# Altium schematic sheet LEDControl1.SchDoc
size A3; SheetNumber: 1; SheetTotal: 3
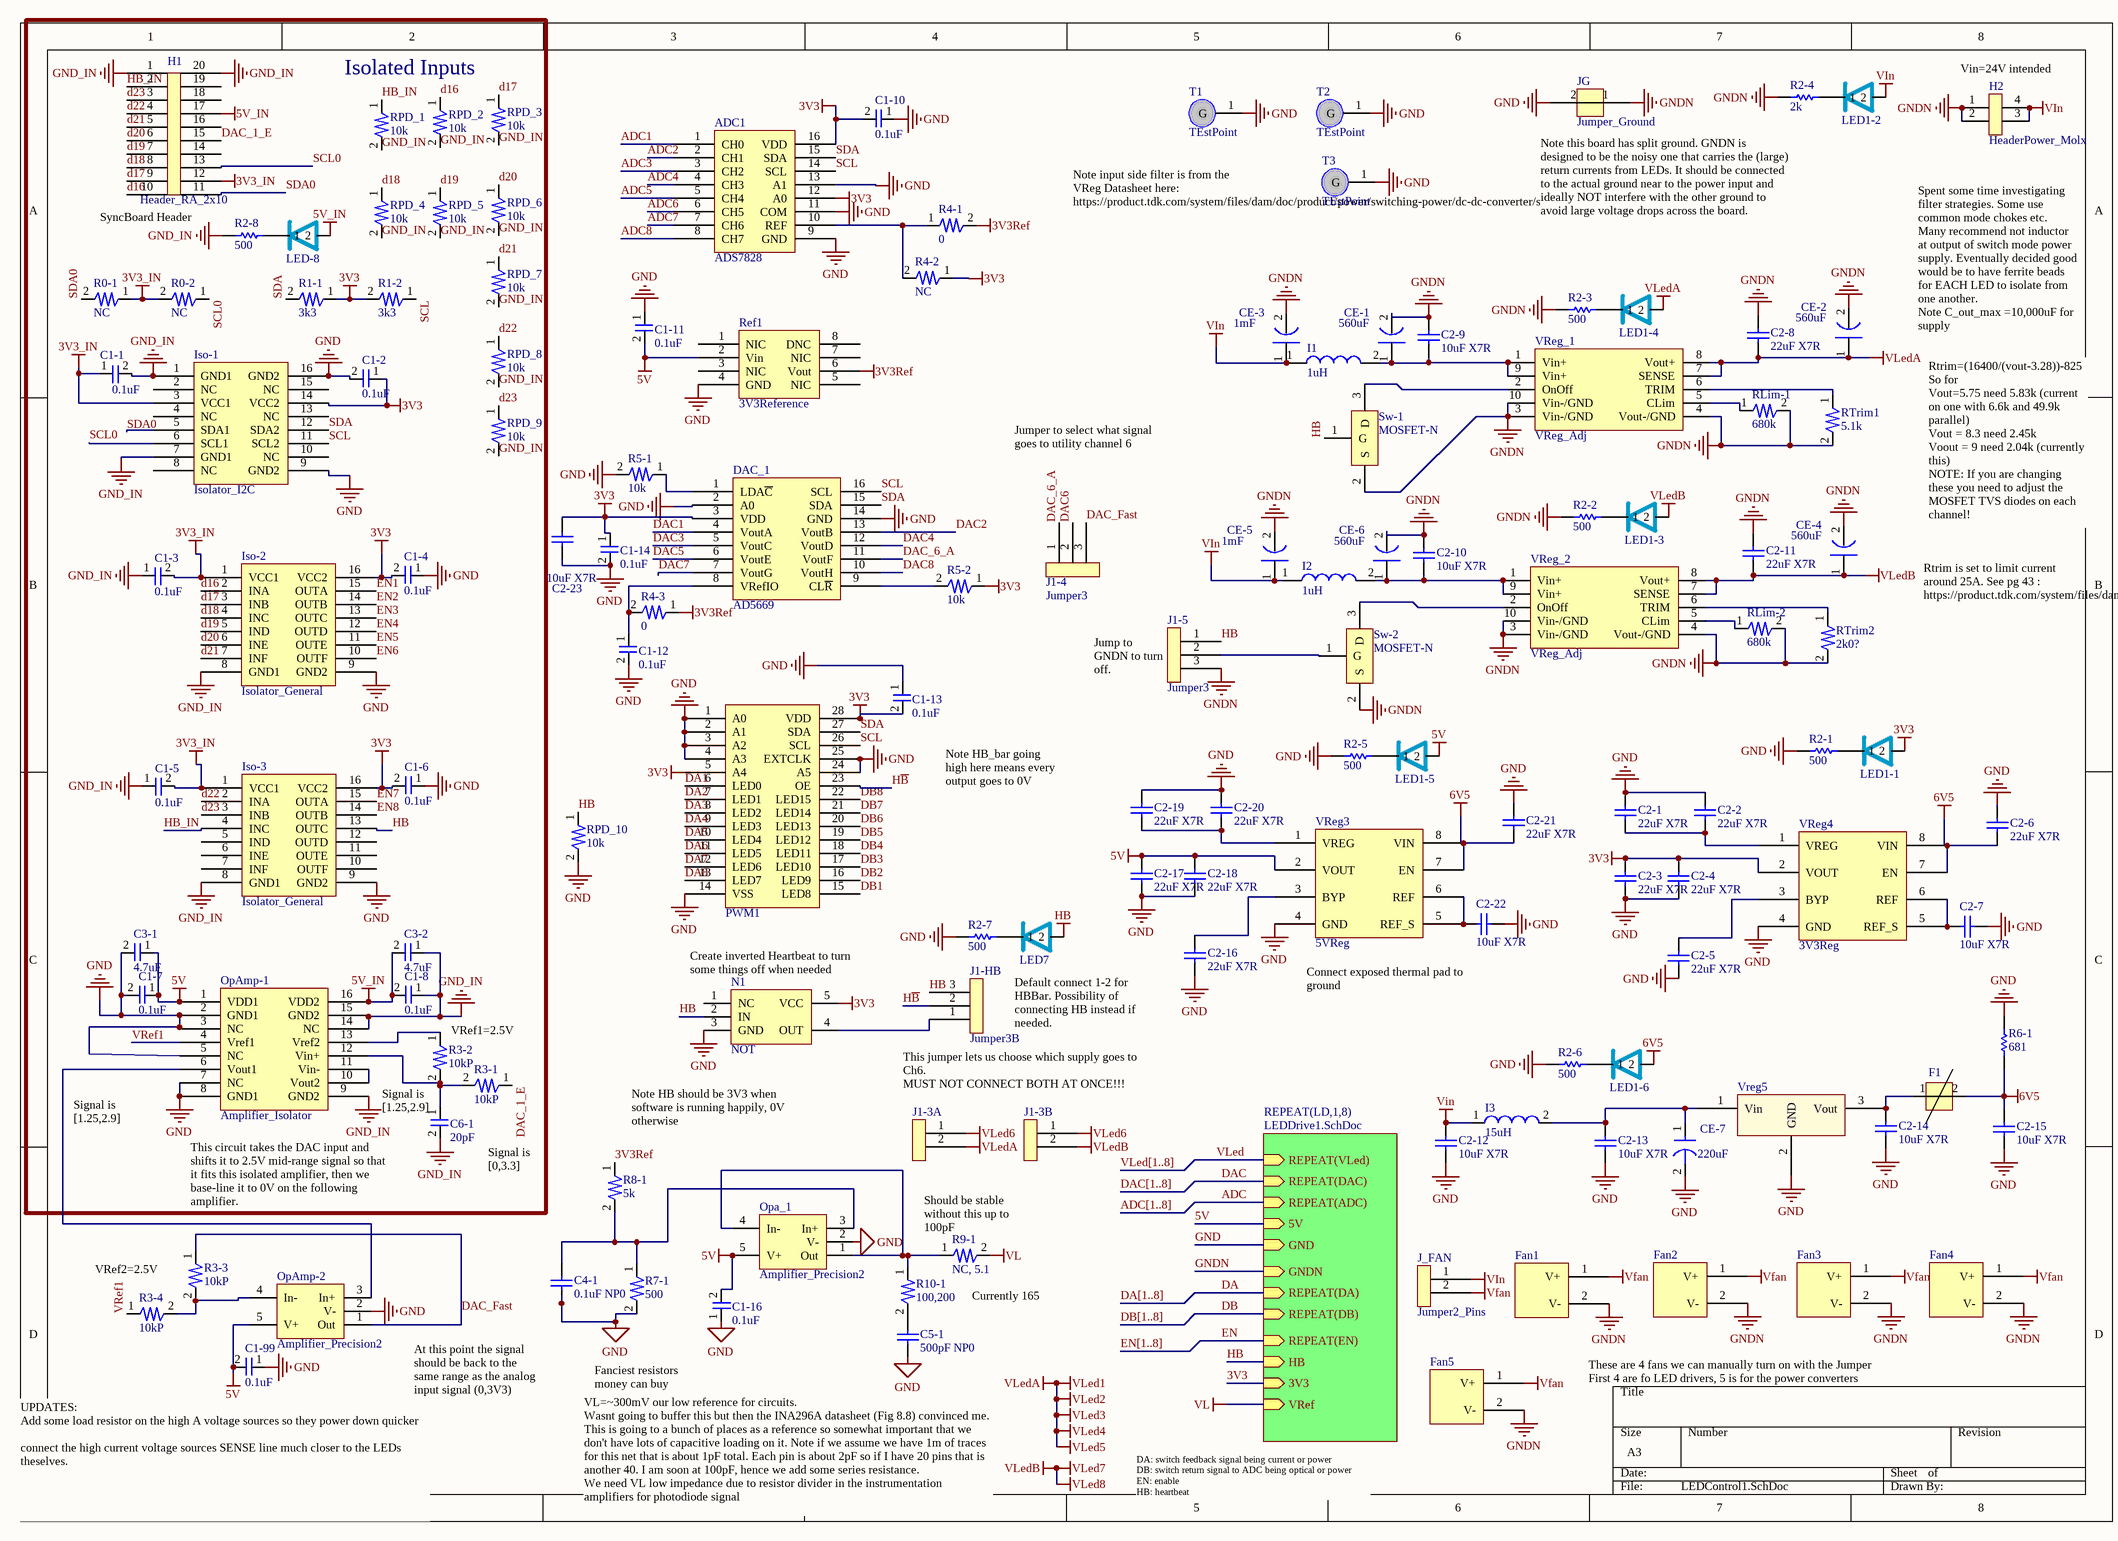
[diagram p0: LEDControl1.SchDoc]

## Parts
ADC1  ADS7828  [16-TSSOP]
C1-1  0.1uF  [0805]
C1-2  0.1uF  [0805]
C1-3  0.1uF  [0805]
C1-4  0.1uF  [0805]
C1-5  0.1uF  [0805]
C1-6  0.1uF  [0805]
C1-7  0.1uF  [0805]
C1-8  0.1uF  [0805]
C1-10  0.1uF  [0805]
C1-11  0.1uF  [0805]
C1-12  0.1uF  [0805]
C1-13  0.1uF  [0805]
C1-14  0.1uF  [0805]
C1-16  0.1uF  [0805]
C1-99  0.1uF  [0805]
C2-1  22uF X7R  [1206]
C2-2  22uF X7R  [1206]
C2-3  22uF X7R  [1206]
C2-4  22uF X7R  [1206]
C2-5  22uF X7R  [1206]
C2-6  22uF X7R  [1206]
C2-7  10uF X7R  [1206]
C2-8  22uF X7R  [1206]
C2-9  10uF X7R  [1206]
C2-10  10uF X7R  [1206]
C2-11  22uF X7R  [1206]
C2-12  10uF X7R  [1206]
C2-13  10uF X7R  [1206]
C2-14  10uF X7R  [1206]
C2-15  10uF X7R  [1206]
C2-16  22uF X7R  [1206]
C2-17  22uF X7R  [1206]
C2-18  22uF X7R  [1206]
C2-19  22uF X7R  [1206]
C2-20  22uF X7R  [1206]
C2-21  22uF X7R  [1206]
C2-22  10uF X7R  [1206]
C2-23  10uF X7R  [1206]
C3-1  4.7uF  [0805]
C3-2  4.7uF  [0805]
C4-1  0.1uF NP0  [1206_Wide]
C5-1  500pF NP0  [0805]
C6-1  20pF  [0805]
CE-1  560uF  [CapElec]
CE-2  560uF  [CapElec]
CE-3  1mF  [CapElec]
CE-4  560uF  [CapElec]
CE-5  1mF  [CapElec]
CE-6  560uF  [CapElec]
CE-7  220uF  [ElectrolyticCapacitor]
DAC_1  AD5669  [16-TSSOP]
F1  FerriteBead1  [FerriteBead1]  (value not drawn)
Fan1  FanIO1  [Fan1]  (value not drawn)
Fan2  FanIO1  [Fan1]  (value not drawn)
Fan3  FanIO1  [Fan1]  (value not drawn)
Fan4  FanIO1  [Fan1]  (value not drawn)
Fan5  FanIO1  [Fan1]  (value not drawn)
H1  Header_RA_2x10  [HeaderRA 2x10]
H2  HeaderPower_Molx  [Header Molex Mini-Fit Jr 5569 - duplicate]
I1  1uH  [Inductor_HighC]
I2  1uH  [Inductor_HighC]
I3  15uH  [Inductor1]
Iso-1  Isolator_I2C  [16-SOIC Wide]
Iso-2  Isolator_General  [16-SOIC Wide]
Iso-3  Isolator_General  [16-SOIC Wide]
J1-3A  Jumper2_HighC  [JumperHighC2]  (value not drawn)
J1-3B  Jumper2_HighC  [JumperHighC2]  (value not drawn)
J1-4  Jumper3  [Jumper]
J1-5  Jumper3  [Jumper]
J1-HB  Jumper3B  [Jumper3B]
J_FAN  Jumper2_Pins  [Jumper2_Pins]
JG  Jumper_Ground  [GndConnector]
LED1-1  LEDindicator  [LEDindicator]  (value not drawn)
LED1-2  LEDindicator  [LEDIndicator]  (value not drawn)
LED1-3  LEDindicator  [LEDindicator]  (value not drawn)
LED1-4  LEDindicator  [LEDindicator]  (value not drawn)
LED1-5  LEDindicator  [LEDindicator]  (value not drawn)
LED1-6  LEDindicator  [LEDindicator]  (value not drawn)
LED7  LEDindicator  [LEDindicator]  (value not drawn)
LED-8  LEDindicator  [LEDindicator]  (value not drawn)
N1  NOT  [SOT23-5]
Opa_1  Amplifier_Precision2  [SOT23-5]
OpAmp-1  Amplifier_Isolator  [16-QSOP]
OpAmp-2  Amplifier_Precision2  [SOT23-5]
PWM1  PWM28  [28-TSSOP]  (value not drawn)
R0-1  NC  [0805]
R0-2  NC  [0805]
R1-1  3k3  [0805]
R1-2  3k3  [0805]
R2-1  500  [0603]
R2-2  500  [0603]
R2-3  500  [0603]
R2-4  2k  [0603]
R2-5  500  [0603]
R2-6  500  [0603]
R2-7  500  [0603]
R2-8  500  [0603]
R3-1  10kP  [0805]
R3-2  10kP  [0805]
R3-3  10kP  [0805]
R3-4  10kP  [0805]
R4-1  0  [0805]
R4-2  NC  [0805]
R4-3  0  [0805]
R5-1  10k  [0805]
R5-2  10k  [0805]
R6-1  681  [1206]
R7-1  500  [1206]
R8-1  5k  [1206]
R9-1  NC, 5.1  [1206]
R10-1  100,200  [0805]
Ref1  3V3Reference  [8-SOIC-NoHeatPad]
RLim-1  680k  [0805]
RLim-2  680k  [0805]
RPD_1  10k  [0603]
RPD_2  10k  [0603]
RPD_3  10k  [0603]
RPD_4  10k  [0603]
RPD_5  10k  [0603]
RPD_6  10k  [0603]
RPD_7  10k  [0603]
RPD_8  10k  [0603]
RPD_9  10k  [0603]
RPD_10  10k  [0603]
RTrim1  5.1k  [0805]
RTrim2  2k0?  [0805]
Sw-1  MOSFET-N  [SOT23-3]
Sw-2  MOSFET-N  [SOT23-3]
T1  TEstPoint  [TestPoint]
T2  TEstPoint  [TestPoint]
T3  TEstPoint  [TestPoint]
VReg3  5VReg  [8-SOIC]
VReg4  3V3Reg  [8-SOIC]
Vreg5  PS1  [PowerSupplySwitch]  (value not drawn)
VReg_1  VReg_Adj  [VReg_SixteenthBrick]
VReg_2  VReg_Adj  [VReg_SixteenthBrick]

## Blocks framed on the sheet
Isolated Inputs: C1-1-C1-8 C3-1 C3-2 C6-1 H1 Iso-1-Iso-3 LED-8 OpAmp-1 R0-1 R0-2 R1-1 R1-2 R2-8 R3-1 R3-2 RPD_1-RPD_9

## Sub-sheets
REPEAT(LD,1,8) = LEDDrive1.SchDoc: REPEAT(VLed) (in), REPEAT(DAC) (in), REPEAT(ADC) (in), 5V (in), GND (in), GNDN (in), REPEAT(DA) (in), REPEAT(DB) (in), REPEAT(EN) (in), HB (in), 3V3 (in), VRef (in)

## Nets
3V3: ADC1.12(A0) ADC1.16(VDD) C1-2.1 C1-4.2 C1-6.2 C1-10.2 C1-13.2 C1-14.1 C2-3.2 C2-4.2 C2-23.2 DAC_1.3(VDD) Iso-1.14(VCC2) Iso-2.16(VCC2) Iso-3.16(VCC2) LED1-1.2 N1.5(VCC) PWM1.5(A4) PWM1.28(VDD) R1-1.1 R1-2.2 R4-2.1 R5-2.1 VReg4.2(VOUT) ; sheet REPEAT(LD,1,8)/3V3
3V3_IN: C1-1.1 C1-3.2 C1-5.2 H1.12 Iso-1.3(VCC1) Iso-2.1(VCC1) Iso-3.1(VCC1) R0-1.1 R0-2.2
3V3Ref: R4-1.2 R4-3.1 R8-1.1 Ref1.6(Vout)
5V: C1-7.1 C1-11.2 C1-16.2 C1-99.2 C2-17.2 C2-18.2 C3-1.1 LED1-5.2 Opa_1.5(V+) OpAmp-1.1(VDD1) OpAmp-2.5(V+) Ref1.2(Vin) VReg3.2(VOUT) ; sheet REPEAT(LD,1,8)/5V
5V_IN: C1-8.2 C3-2.2 H1.17 LED-8.2 OpAmp-1.16(VDD2)
6V5: C2-6.1 C2-15.1 C2-21.1 F1.2 LED1-6.2 R6-1.2 VReg3.7(EN) VReg3.8(VIN) VReg4.7(EN) VReg4.8(VIN)
GND: ADC1.9(GND) ADC1.11(COM) ADC1.13(A1) C1-2.2 C1-4.1 C1-6.1 C1-7.2 C1-10.1 C1-11.1 C1-12.2 C1-13.1 C1-14.2 C1-16.1 C1-99.1 C2-1.2 C2-2.2 C2-3.1 C2-4.1 C2-5.1 C2-6.2 C2-7.1 C2-12.2 C2-13.2 C2-14.2 C2-15.2 C2-16.1 C2-17.1 C2-18.1 C2-19.2 C2-20.2 C2-21.2 C2-22.1 C2-23.1 C3-1.2 C4-1.2 C5-1.1 CE-7.2 DAC_1.2(A0) DAC_1.14(GND) Iso-1.9(GND2) Iso-1.16(GND2) Iso-2.9(GND2) Iso-3.9(GND2) JG.2 N1.3(GND) Opa_1.2(V-) OpAmp-1.2(GND1) OpAmp-1.3(NC) OpAmp-1.5(NC) OpAmp-1.7(NC) OpAmp-1.8(GND1) OpAmp-2.2(V-) PWM1.1(A0) PWM1.2(A1) PWM1.3(A2) PWM1.4(A3) PWM1.14(VSS) PWM1.24(A5) PWM1.25(EXTCLK) R2-1.2 R2-5.2 R2-6.2 R2-7.2 R5-1.2 R6-1.1 R7-1.2 Ref1.4(GND) RPD_10.2 T1.1(G) T2.1(G) T3.1(G) VReg3.4(GND) VReg4.4(GND) Vreg5.2(GND) ; sheet REPEAT(LD,1,8)/GND
GND_IN: C1-1.2 C1-3.1 C1-5.1 C1-8.1 C3-2.1 C6-1.2 H1.1 H1.20 Iso-1.1(GND1) Iso-1.7(GND1) Iso-2.8(GND1) Iso-3.8(GND1) OpAmp-1.9(GND2) OpAmp-1.14(NC) OpAmp-1.15(GND2) R2-8.2 RPD_1.2 RPD_2.2 RPD_3.2 RPD_4.2 RPD_5.2 RPD_6.2 RPD_7.2 RPD_8.2 RPD_9.2
GNDN: C2-8.2 C2-9.2 C2-10.2 C2-11.2 CE-1.2 CE-2.2 CE-3.2 CE-4.2 CE-5.2 CE-6.2 Fan1.2(V-) Fan2.2(V-) Fan3.2(V-) Fan4.2(V-) Fan5.2(V-) H2.1 H2.2 J1-5.3 JG.1 R2-2.2 R2-3.2 R2-4.2 RLim-1.2 RLim-2.2 RTrim1.2 RTrim2.2 Sw-1.2(S) Sw-2.2(S) VReg_1.3(Vin-/GND) VReg_1.4(Vout-/GND) VReg_1.10(Vin-/GND) VReg_2.3(Vin-/GND) VReg_2.4(Vout-/GND) VReg_2.10(Vin-/GND) ; sheet REPEAT(LD,1,8)/GNDN
HB: Iso-3.13(OUTC) J1-5.1 J1-HB.3 LED7.2 N1.2(IN) RPD_10.1 Sw-1.1(G) ; sheet REPEAT(LD,1,8)/HB
Vfan: Fan1.1(V+) Fan2.1(V+) Fan3.1(V+) Fan4.1(V+) Fan5.1(V+) J_FAN.2
VIn: C2-12.1 CE-3.1 CE-5.1 H2.3 H2.4 I1.1 I2.1 I3.1 J_FAN.1 LED1-2.2
VL: R9-1.2 ; sheet REPEAT(LD,1,8)/VRef
VLed1: C2-8.1 CE-2.1 J1-3A.2 LED1-4.2 VReg_1.7(SENSE) VReg_1.8(Vout+)  [also labelled VLed2, VLed3, VLed4, VLed5, VLedA]
VLed6: J1-3A.1 J1-3B.1
VLed7: C2-11.1 CE-4.1 J1-3B.2 LED1-3.2 VReg_2.7(SENSE) VReg_2.8(Vout+)  [also labelled VLed8, VLedB]
ADC: sheet REPEAT(LD,1,8)/REPEAT(ADC)
ADC1: ADC1.1(CH0)
ADC2: ADC1.2(CH1)
ADC3: ADC1.3(CH2)
ADC4: ADC1.4(CH3)
ADC5: ADC1.5(CH4)
ADC6: ADC1.6(CH5)
ADC7: ADC1.7(CH6)
ADC8: ADC1.8(CH7)
d16: H1.10 Iso-2.2(INA) RPD_2.1
d17: H1.9 Iso-2.3(INB) RPD_3.1
d18: H1.8 Iso-2.4(INC) RPD_4.1
d19: H1.7 Iso-2.5(IND) RPD_5.1
d20: H1.6 Iso-2.6(INE) RPD_6.1
d21: H1.5 Iso-2.7(INF) RPD_7.1
d22: H1.4 Iso-3.2(INA) RPD_8.1
d23: H1.3 Iso-3.3(INB) RPD_9.1
DA: sheet REPEAT(LD,1,8)/REPEAT(DA)
DA1: PWM1.6(LED0)
DA2: PWM1.7(LED1)
DA3: PWM1.8(LED2)
DA4: PWM1.9(LED3)
DA5: PWM1.10(LED4)
DA6: PWM1.11(LED5)
DA7: PWM1.12(LED6)
DA8: PWM1.13(LED7)
DAC: sheet REPEAT(LD,1,8)/REPEAT(DAC)
DAC1: DAC_1.4(VoutA)
DAC2: DAC_1.13(VoutB)
DAC3: DAC_1.5(VoutC)
DAC4: DAC_1.12(VoutD)
DAC5: DAC_1.6(VoutE)
DAC6: J1-4.2
DAC7: DAC_1.7(VoutG)
DAC8: DAC_1.10(VoutH)
DAC_1_E: H1.15 R3-1.1
DAC_6_A: DAC_1.11(VoutF) J1-4.1
DAC_Fast: J1-4.3 OpAmp-2.1(Out) R3-3.1
DB: sheet REPEAT(LD,1,8)/REPEAT(DB)
DB1: PWM1.15(LED8)
DB2: PWM1.16(LED9)
DB3: PWM1.17(LED10)
DB4: PWM1.18(LED11)
DB5: PWM1.19(LED12)
DB6: PWM1.20(LED13)
DB7: PWM1.21(LED14)
DB8: PWM1.22(LED15)
EN: sheet REPEAT(LD,1,8)/REPEAT(EN)
EN1: Iso-2.15(OUTA)
EN2: Iso-2.14(OUTB)
EN3: Iso-2.13(OUTC)
EN4: Iso-2.12(OUTD)
EN5: Iso-2.11(OUTE)
EN6: Iso-2.10(OUTF)
EN7: Iso-3.15(OUTA)
EN8: Iso-3.14(OUTB)
H~{B}: J1-HB.2 PWM1.23(OE)
HB_IN: H1.2 Iso-3.4(INC) RPD_1.1
SCL: ADC1.14(SCL) DAC_1.16(SCL) Iso-1.11(SCL2) PWM1.26(SCL) R1-2.1
SCL0: H1.13 Iso-1.6(SCL1) R0-2.1
SDA: ADC1.15(SDA) DAC_1.15(SDA) Iso-1.12(SDA2) PWM1.27(SDA) R1-1.2
SDA0: H1.11 Iso-1.5(SDA1) R0-1.2
VLed: sheet REPEAT(LD,1,8)/REPEAT(VLed)
VRef1: OpAmp-1.4(Vref1) R3-4.1
NetADC1_10: ADC1.10(REF) R4-1.1 R4-2.2
NetC1-12_1: C1-12.1 DAC_1.8(VRefIO) R4-3.2
NetC2-1_1: C2-1.1 C2-2.1 VReg4.1(VREG)
NetC2-5_2: C2-5.2 VReg4.3(BYP)
NetC2-7_2: C2-7.2 VReg4.5(REF_S) VReg4.6(REF)
NetC2-9_1: C2-9.1 CE-1.1 I1.2 VReg_1.1(Vin+) VReg_1.9(Vin+)
NetC2-10_1: C2-10.1 CE-6.1 I2.2 VReg_2.1(Vin+) VReg_2.9(Vin+)
NetC2-13_1: C2-13.1 CE-7.1 I3.2 Vreg5.1(Vin)
NetC2-14_1: C2-14.1 F1.1 Vreg5.3(Vout)
NetC2-16_2: C2-16.2 VReg3.3(BYP)
NetC2-19_1: C2-19.1 C2-20.1 VReg3.1(VREG)
NetC2-22_2: C2-22.2 VReg3.5(REF_S) VReg3.6(REF)
NetC4-1_1: C4-1.1 Opa_1.3(In+) R7-1.1 R8-1.2
NetC5-1_2: C5-1.2 R10-1.2
NetC6-1_1: C6-1.1 OpAmp-1.12(Vin+) R3-1.2 R3-2.2
NetDAC_1_1: DAC_1.1(LDA~{C}) R5-1.1
NetDAC_1_9: DAC_1.9(CL~{R}) R5-2.2
NetJ1-5_2: J1-5.2 Sw-2.1(G)
NetJ1-HB_1: J1-HB.1 N1.4(OUT)
NetLED1-1_1: LED1-1.1 R2-1.1
NetLED1-2_1: LED1-2.1 R2-4.1
NetLED1-3_1: LED1-3.1 R2-2.1
NetLED1-4_1: LED1-4.1 R2-3.1
NetLED1-5_1: LED1-5.1 R2-5.1
NetLED1-6_1: LED1-6.1 R2-6.1
NetLED7_1: LED7.1 R2-7.1
NetLED-8_1: LED-8.1 R2-8.1
NetOpa_1_1: Opa_1.1(Out) Opa_1.4(In-) R9-1.1 R10-1.1
NetOpAmp-1_6: OpAmp-1.6(Vout1) OpAmp-2.3(In+)
NetOpAmp-1_10: OpAmp-1.10(Vout2) OpAmp-1.11(Vin-)
NetOpAmp-1_13: OpAmp-1.13(Vref2) R3-2.1
NetOpAmp-2_4: OpAmp-2.4(In-) R3-3.2 R3-4.2
NetRLim-1_1: RLim-1.1 VReg_1.5(CLim)
NetRLim-2_1: RLim-2.1 VReg_2.5(CLim)
NetRTrim1_1: RTrim1.1 VReg_1.6(TRIM)
NetRTrim2_1: RTrim2.1 VReg_2.6(TRIM)
NetSw-1_3: Sw-1.3(D) VReg_1.2(OnOff)
NetSw-2_3: Sw-2.3(D) VReg_2.2(OnOff)

Not connected (* = marked no-connect by the designer): H1 14 16 18 19; Iso-1 2(NC) 4(NC) 8(NC) 10(NC) 13(NC) 15(NC); Iso-3 5(IND) 6(INE) 7(INF) 10(OUTF) 11(OUTE) 12(OUTD); N1 1(NC); Ref1 1(NIC) 3(NIC) 5(NIC) 7(NIC) 8(DNC)

## Buses and harness runs
bus ADC[1..8]
bus DA[1..8]
bus DAC[1..8]
bus DB[1..8]
bus EN[1..8]
bus VLed[1..8]

## Notes on the sheet
- (near H2) Vin=24V intended
- (near R2-8) SyncBoard Header
- (near T1) Note input side filter is from the VReg Datasheet here: https://product.tdk.com/system/files/dam/doc/product/power/switching-power/dc-dc-converter/specification/i7a_spec.pdf
- Note this board has split ground. GNDN is designed to be the noisy one that carries the (large) return currents from LEDs. It should be connected to the actual ground near to the power input and ideally NOT interfere with the other ground to avoid large voltage drops across the board.
- Spent some time investigating filter strategies. Some use common mode chokes etc. Many recommend not inductor at output of switch mode power supply. Eventually decided good would be to have ferrite beads for EACH LED to isolate from one another.
  Note C_out_max =10,000uF for supply
- Jumper to select what signal goes to utility channel 6
- Rtrim=(16400/(vout-3.28))-825
  So for
  Vout=5.75 need 5.83k (current on one with 6.6k and 49.9k parallel)
  Vout = 8.3 need 2.45k
  Voout = 9 need 2.04k (currently  this)
  NOTE: If you are changing these you need to adjust the MOSFET TVS diodes on each channel!
- (near J1-5) Jump to GNDN to turn off.
- Rtrim is set to limit current around 25A. See pg 43 : https://product.tdk.com/system/files/dam/doc/product/power/switching-power/dc-dc-converter/specification/i7a_spec.pdf
- Note HB_bar going high here means every output goes to 0V
- (near N1) Create inverted Heartbeat to turn some things off when needed
- Connect exposed thermal pad to ground
- (near R3-2) VRef1=2.5V
- Default connect 1-2 for HBBar. Possibility of connecting HB instead if needed.
- Signal is [1.25,2.9]
- (near C6-1) Signal is [1.25,2.9]
- Note HB should be 3V3 when software is running happily, 0V otherwise
- This jumper lets us choose which supply goes to Ch6.
  MUST NOT CONNECT BOTH AT ONCE!!!
- This circuit takes the DAC input and shifts it to 2.5V mid-range signal so that it fits this isolated amplifier, then we base-line it to 0V on the following amplifier.
- Signal is [0,3.3]
- (near R3-3) VRef2=2.5V
- (near R9-1) Should be stable without this up to 100pF
- (near R9-1) Currently 165
- At this point the signal should be back to the same range as the analog input signal (0,3V3)
- Fanciest resistors money can buy
- These are 4 fans we can manually turn on with the Jumper
  First 4 are fo LED drivers, 5 is for the power converters
- (near C1-99) UPDATES:
  Add some load resistor on the high A voltage sources so they power down quicker
  connect the high current voltage sources SENSE line much closer to the LEDs theselves.
- (near C5-1) VL=~300mV our low reference for circuits.
  Wasnt going to buffer this but then the INA296A datasheet (Fig 8.8) convinced me.
  This is going to a bunch of places as a reference so somewhat important that we don't have lots of capacitive loading on it. Note if we assume we have 1m of traces for this net that is about 1pF total. Each pin is about 2pF so if I have 20 pins that is another 40. I am soon at 100pF, hence we add some series resistance.
  We need VL low impedance due to resistor divider in the instrumentation amplifiers for photodiode signal
- DA: switch feedback signal being current or power
  DB: switch return signal to ADC being optical or power
  EN: enable
  HB: heartbeat

## Library data of the parts
C1-1-C1-8 C1-10-C1-14 C1-16 C1-99 C3-1 C3-2 C6-1 = Capacitor1
C2-1-C2-23 C4-1 C5-1 = Cap 0805: Capacitor
  C2-1-C2-6 C2-8 C2-11 C2-16-C2-21: Digikey P/N: 490-14439-1-ND
  C2-7 C2-9 C2-10 C2-12-C2-15 C2-22 C2-23: Digikey P/N: 587-3485-1-ND
  C4-1: Digikey P/N: 445-6984-1-ND
  C5-1: Digikey P/N: 311-4178-1-ND
CE-1-CE-6 = CapElectrolytic
  CE-1 CE-2 CE-4 CE-6: Digikey P/N: 565-3414-ND
  CE-3 CE-5: Digikey P/N: 732-9249-1-ND
CE-7 = CapElectrolytic2: ElectrolyticCap; Digikey P/N: PCE5120CT-ND
I1 I2 = Inductor1: Digikey P/N: 732-13630-ND
I3 = Inductor3: Inductor; Digikey P/N: 732-11747-1-ND
PWM1 = PWM28: PWM; Digikey P/N: 568-11925-1-ND
R0-1 R0-2 R1-1 R1-2 R3-1-R3-4 R4-1-R4-3 R5-1 R5-2 R7-1 R8-1 R9-1 R10-1 RLim-1 RLim-2 RPD_1-RPD_10 RTrim1 RTrim2 = Res1
  R3-1 R3-2: Digikey P/N: 541-4663-1-ND
  R7-1: Digikey P/N: Y1625500R000B9W-ND
  R8-1: Digikey P/N: Y4023-5.00KDCT-ND
  R9-1: Digikey P/N: YAG5091CT-ND, RMCF1206ZT0R00CT-ND
  R10-1: Digikey P/N: RNCF0805BTE100RCT-ND, P20937CT-ND
  RLim-1 RLim-2: Digikey P/N: P680KDACT-ND
  RTrim2: Digikey P/N: P21058CT-ND
R2-1-R2-8 R6-1 = Res1: Resistor
  R2-1 R2-2 R2-5-R2-8: Digikey P/N: 2019-RK73B1JTTD201JCT-ND; Footprint: 0603 (1608 Metric)
  R2-3 R2-4: Digikey P/N: P2KBZCT-ND; Footprint: 0603 (1608 Metric)
  R6-1: Digikey P/N: 541-4611-1-ND
Ref1 = 2V5Ref: Digikey P/N: 505-ADR4533BRZ-R7CT-ND
VReg3 = 5V Reg LowNoise: 5V Regulator Low Noise; Digikey P/N: ADM7150ARDZ-5.0-R7CT-ND
VReg4 = 5V Reg LowNoise: 3V3 Regulator Low Noise; Digikey P/N: 505-ADM7150ARDZ-3.3-R7CT-ND
Vreg5 = PowerSupplySwitching: Digikey P/N: 945-2647-5-ND
ADC1 = ADS7828: Digikey P/N: 296-24101-1-ND
DAC_1 = AD5669: Digikey P/N: AD5669RARUZ-1
F1 = FerriteBead1: Digikey P/N: 4816-BPH853025R5-101TCT-ND
Fan1-Fan5 = FanIO1: Digikey P/N: 603-2189-ND, 36-633-ND
H1 = Header_RA_2x10: Digikey P/N: SAM8104-ND, SAM8089-ND
H2 = HeaderPower_Molx: Digikey P/N: WM23323-ND, 1470-4875-ND
Iso-1 = Isolator_I2C: Digikey P/N: 296-ISO1640QDWRQ1CT-ND
Iso-2 Iso-3 = Isolator_General: Digikey P/N: 296-ISO7760FDWRCT-ND
J1-4 J1-5 = Jumper3: Digikey P/M: 609-3461-ND, S9000-ND
J1-HB = Jumper3B: Digikey P/M: 609-3461-ND, S9000-ND
J_FAN = Jumper2_Pins: Digikey P/M: 609-3461-ND, S9000-ND
LED1-1-LED1-6 LED7 LED-8 = LEDindicator: Digikey: https://www.digikey.co.uk/product-detail/en/osram-opto-semiconductors-inc/LG-R971-KN-1/475-1410-1-ND/1802598; Digikey P/N: 475-1410-1-ND
N1 = NOT: Digikey P/N: 296-11607-1-ND
Opa_1 OpAmp-2 = Amplifier_Precision2: Digikey P/N: 296-OPA388QDBVRQ1CT-ND
OpAmp-1 = Amplifier_Isolator: Digikey P/N: 505-ADUM3195WBRQZ-ND
Sw-1 Sw-2 = MOSFET-N: Digikey P/N: DMG3402L-7DICT-ND
T1-T3 = TEstPoint: Digikey P/N: 36-5014-ND
VReg_1 VReg_2 = VReg_Adj: Digikey P/N: 285-I7A24045A033V-0F3-R-ND